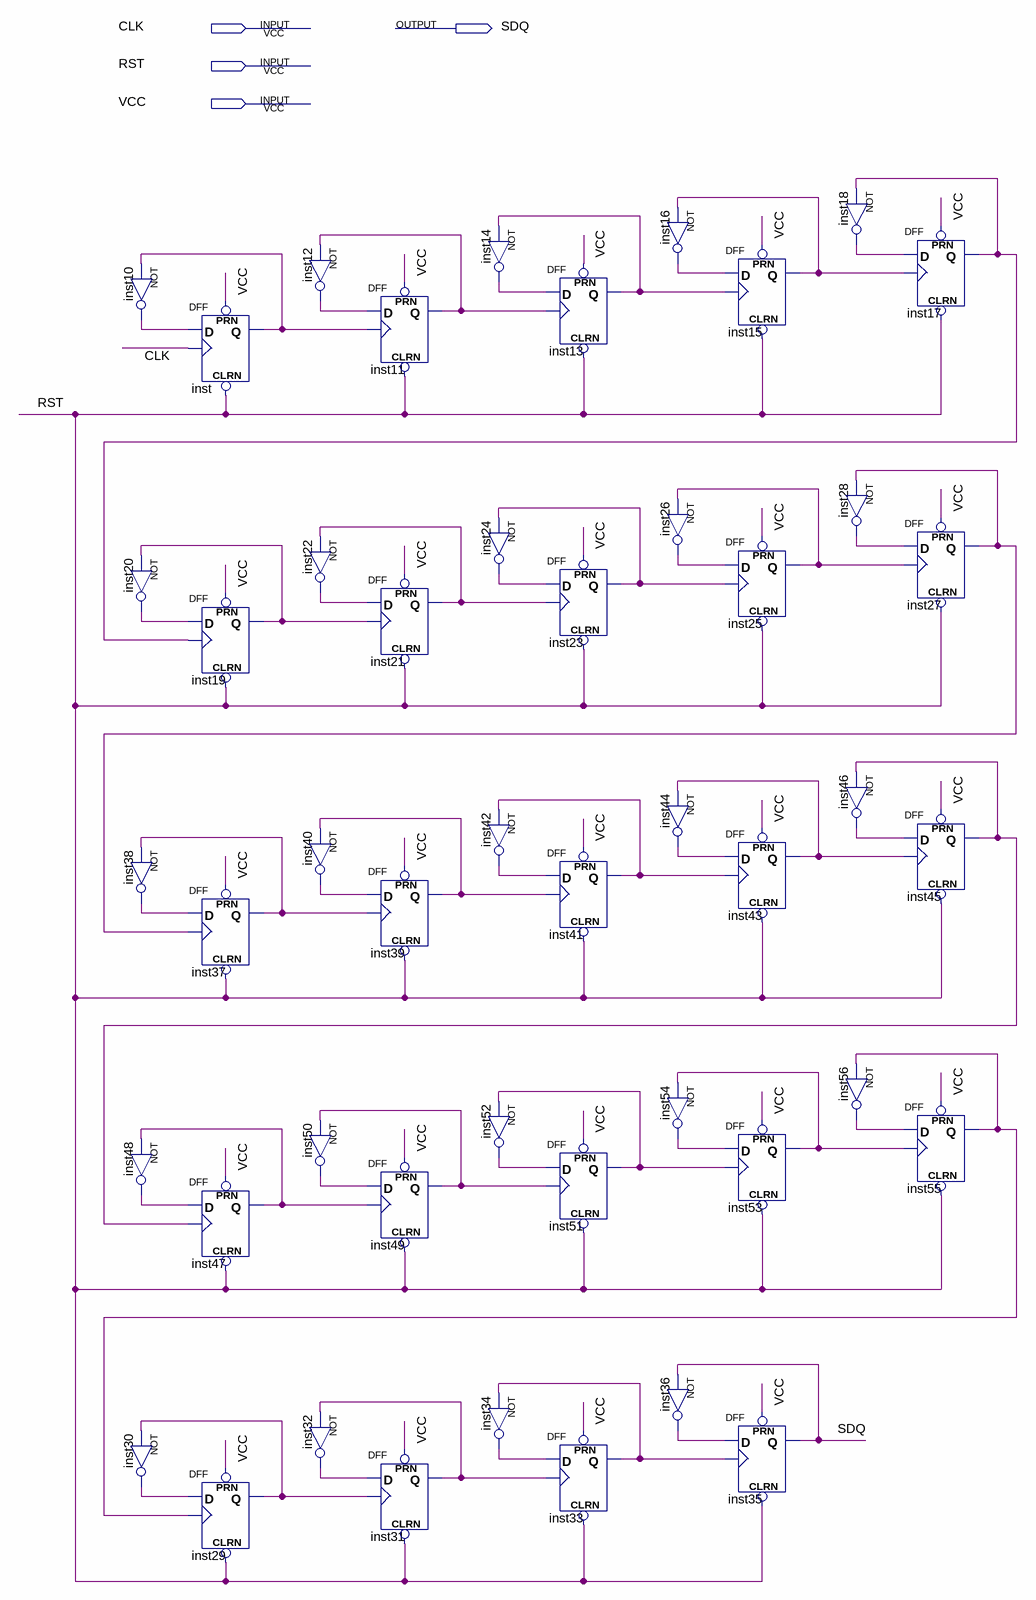
[diagram p0: schematic sheet]
// Quartus schematic divisor.bdf as structural Verilog: 48 symbols, 4 pins
module divisor (
  input  CLK,
  input  RST,
  input  VCC,
  output SDQ
);

  wire inst10_out, inst11_q, inst12_out, inst13_q, inst14_out, inst15_q, inst16_out, inst17_q, inst18_out,
       inst19_q, inst20_out, inst21_q, inst22_out, inst23_q, inst24_out, inst25_q, inst26_out, inst27_q,
       inst28_out, inst29_q, inst30_out, inst31_q, inst32_out, inst33_q, inst34_out, inst36_out, inst37_q,
       inst38_out, inst39_q, inst40_out, inst41_q, inst42_out, inst43_q, inst44_out, inst45_q, inst46_out,
       inst47_q, inst48_out, inst49_q, inst50_out, inst51_q, inst52_out, inst53_q, inst54_out, inst55_q,
       inst56_out, inst_q;

  not inst10 (inst10_out, inst_q);
  not inst20 (inst20_out, inst19_q);
  not inst38 (inst38_out, inst37_q);
  not inst48 (inst48_out, inst47_q);
  not inst30 (inst30_out, inst29_q);
  DFF inst (.CLRN(RST), .CLK(CLK), .D(inst10_out), .PRN(VCC), .Q(inst_q));
  DFF inst19 (.CLRN(RST), .CLK(inst17_q), .D(inst20_out), .PRN(VCC), .Q(inst19_q));
  DFF inst37 (.CLRN(RST), .CLK(inst27_q), .D(inst38_out), .PRN(VCC), .Q(inst37_q));
  DFF inst47 (.CLRN(RST), .CLK(inst45_q), .D(inst48_out), .PRN(VCC), .Q(inst47_q));
  DFF inst29 (.CLRN(RST), .CLK(inst55_q), .D(inst30_out), .PRN(VCC), .Q(inst29_q));
  not inst12 (inst12_out, inst11_q);
  not inst22 (inst22_out, inst21_q);
  not inst40 (inst40_out, inst39_q);
  not inst50 (inst50_out, inst49_q);
  not inst32 (inst32_out, inst31_q);
  DFF inst11 (.CLRN(RST), .CLK(inst_q), .D(inst12_out), .PRN(VCC), .Q(inst11_q));
  DFF inst21 (.CLRN(RST), .CLK(inst19_q), .D(inst22_out), .PRN(VCC), .Q(inst21_q));
  DFF inst39 (.CLRN(RST), .CLK(inst37_q), .D(inst40_out), .PRN(VCC), .Q(inst39_q));
  DFF inst49 (.CLRN(RST), .CLK(inst47_q), .D(inst50_out), .PRN(VCC), .Q(inst49_q));
  DFF inst31 (.CLRN(RST), .CLK(inst29_q), .D(inst32_out), .PRN(VCC), .Q(inst31_q));
  not inst14 (inst14_out, inst13_q);
  DFF inst13 (.CLRN(RST), .CLK(inst11_q), .D(inst14_out), .PRN(VCC), .Q(inst13_q));
  not inst24 (inst24_out, inst23_q);
  DFF inst23 (.CLRN(RST), .CLK(inst21_q), .D(inst24_out), .PRN(VCC), .Q(inst23_q));
  not inst42 (inst42_out, inst41_q);
  DFF inst41 (.CLRN(RST), .CLK(inst39_q), .D(inst42_out), .PRN(VCC), .Q(inst41_q));
  not inst52 (inst52_out, inst51_q);
  DFF inst51 (.CLRN(RST), .CLK(inst49_q), .D(inst52_out), .PRN(VCC), .Q(inst51_q));
  not inst34 (inst34_out, inst33_q);
  DFF inst33 (.CLRN(RST), .CLK(inst31_q), .D(inst34_out), .PRN(VCC), .Q(inst33_q));
  not inst16 (inst16_out, inst15_q);
  not inst26 (inst26_out, inst25_q);
  not inst44 (inst44_out, inst43_q);
  not inst54 (inst54_out, inst53_q);
  not inst36 (inst36_out, SDQ);
  DFF inst15 (.CLRN(RST), .CLK(inst13_q), .D(inst16_out), .PRN(VCC), .Q(inst15_q));
  DFF inst25 (.CLRN(RST), .CLK(inst23_q), .D(inst26_out), .PRN(VCC), .Q(inst25_q));
  DFF inst43 (.CLRN(RST), .CLK(inst41_q), .D(inst44_out), .PRN(VCC), .Q(inst43_q));
  DFF inst53 (.CLRN(RST), .CLK(inst51_q), .D(inst54_out), .PRN(VCC), .Q(inst53_q));
  DFF inst35 (.CLRN(RST), .CLK(inst33_q), .D(inst36_out), .PRN(VCC), .Q(SDQ));
  not inst18 (inst18_out, inst17_q);
  not inst28 (inst28_out, inst27_q);
  not inst46 (inst46_out, inst45_q);
  not inst56 (inst56_out, inst55_q);
  DFF inst17 (.CLRN(RST), .CLK(inst15_q), .D(inst18_out), .PRN(VCC), .Q(inst17_q));
  DFF inst27 (.CLRN(RST), .CLK(inst25_q), .D(inst28_out), .PRN(VCC), .Q(inst27_q));
  DFF inst45 (.CLRN(RST), .CLK(inst43_q), .D(inst46_out), .PRN(VCC), .Q(inst45_q));
  DFF inst55 (.CLRN(RST), .CLK(inst53_q), .D(inst56_out), .PRN(VCC), .Q(inst55_q));
endmodule
